# EAGLE schematic Slave BMS ESKD (EAGLE 9.5.2)
Assembly variants: Full_Assembly_TOP, Full_Assembly_BOT, PC_Test_TOP, PC_Test_BOT
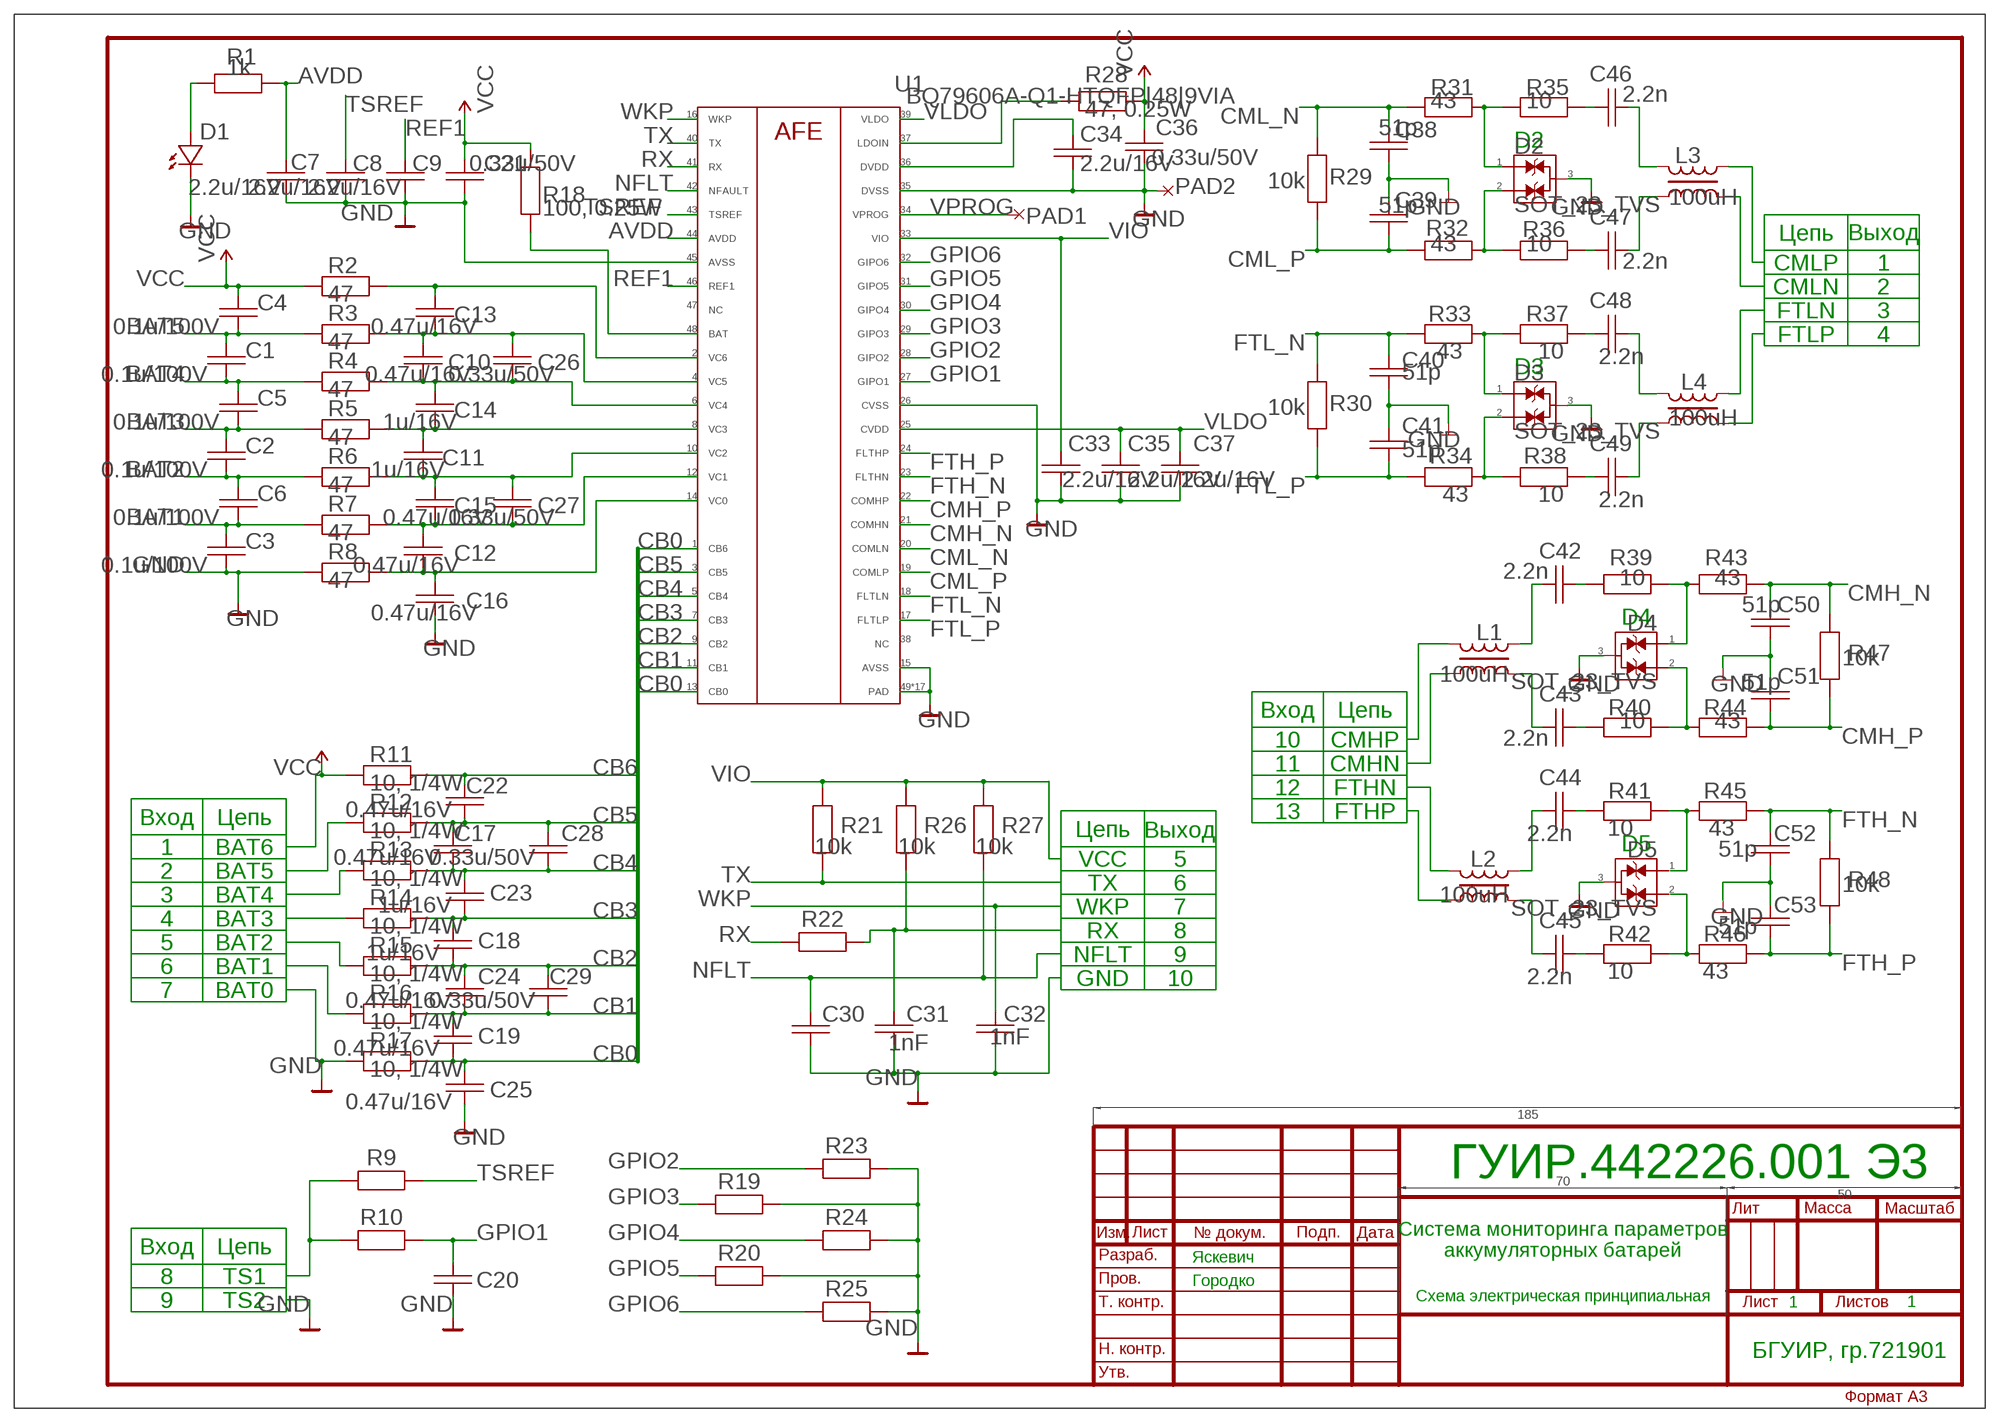
[diagram p0: schematic, sheet 1]

## Parts
C1  0.1u/100V  ESCD_CAP  [C1206]  (not fitted in variant Full_Assembly_BOT)  (not fitted in variant PC_Test_BOT)
C2  0.1u/100V  ESCD_CAP  [C1206]  (not fitted in variant Full_Assembly_BOT)  (not fitted in variant PC_Test_BOT)
C3  0.1u/100V  ESCD_CAP  [C1206]  (not fitted in variant Full_Assembly_BOT)  (not fitted in variant PC_Test_BOT)
C4  0.1u/100V  ESCD_CAP  [C1206]  (not fitted in variant Full_Assembly_BOT)  (not fitted in variant PC_Test_BOT)
C5  0.1u/100V  ESCD_CAP  [C1206]  (not fitted in variant Full_Assembly_BOT)  (not fitted in variant PC_Test_BOT)
C6  0.1u/100V  ESCD_CAP  [C1206]  (not fitted in variant Full_Assembly_BOT)  (not fitted in variant PC_Test_BOT)
C7  2.2u/16V  ESCD_CAP  [C1206]  (not fitted in variant Full_Assembly_BOT)  (not fitted in variant PC_Test_BOT)
C8  2.2u/16V  ESCD_CAP  [C1206]  (not fitted in variant Full_Assembly_BOT)  (not fitted in variant PC_Test_BOT)
C9  2.2u/16V  ESCD_CAP  [C1206]  (not fitted in variant Full_Assembly_BOT)  (not fitted in variant PC_Test_BOT)
C10  0.47u/16V  ESCD_CAP  [C1206]  (not fitted in variant Full_Assembly_BOT)  (not fitted in variant PC_Test_BOT)
C11  1u/16V  ESCD_CAP  [C1206]  (not fitted in variant Full_Assembly_BOT)  (not fitted in variant PC_Test_BOT)
C12  0.47u/16V  ESCD_CAP  [C1206]  (not fitted in variant Full_Assembly_BOT)  (not fitted in variant PC_Test_BOT)
C13  0.47u/16V  ESCD_CAP  [C1206]  (not fitted in variant Full_Assembly_BOT)  (not fitted in variant PC_Test_BOT)
C14  1u/16V  ESCD_CAP  [C1206]  (not fitted in variant Full_Assembly_BOT)  (not fitted in variant PC_Test_BOT)
C15  0.47u/16V  ESCD_CAP  [C1206]  (not fitted in variant Full_Assembly_BOT)  (not fitted in variant PC_Test_BOT)
C16  0.47u/16V  ESCD_CAP  [C1206]  (not fitted in variant Full_Assembly_BOT)  (not fitted in variant PC_Test_BOT)
C17  0.47u/16V  ESCD_CAP  [C1206]  (not fitted in variant Full_Assembly_BOT)  (not fitted in variant PC_Test_BOT)
C18  1u/16V  ESCD_CAP  [C1206]  (not fitted in variant Full_Assembly_BOT)  (not fitted in variant PC_Test_BOT)
C19  0.47u/16V  ESCD_CAP  [C1206]  (not fitted in variant Full_Assembly_BOT)  (not fitted in variant PC_Test_BOT)
C20  ESCD_CAP  [C1206]
C21  0.33u/50V  ESCD_CAP  [C1206]  (not fitted in variant Full_Assembly_BOT)  (not fitted in variant PC_Test_BOT)
C22  0.47u/16V  ESCD_CAP  [C1206]  (not fitted in variant Full_Assembly_BOT)  (not fitted in variant PC_Test_BOT)
C23  1u/16V  ESCD_CAP  [C1206]  (not fitted in variant Full_Assembly_BOT)  (not fitted in variant PC_Test_BOT)
C24  0.47u/16V  ESCD_CAP  [C1206]  (not fitted in variant Full_Assembly_BOT)  (not fitted in variant PC_Test_BOT)
C25  0.47u/16V  ESCD_CAP  [C1206]  (not fitted in variant Full_Assembly_BOT)  (not fitted in variant PC_Test_BOT)
C26  0.33u/50V  ESCD_CAP  [C1206]  (not fitted in variant Full_Assembly_BOT)  (not fitted in variant PC_Test_BOT)
C27  0.33u/50V  ESCD_CAP  [C1206]  (not fitted in variant Full_Assembly_BOT)  (not fitted in variant PC_Test_BOT)
C28  0.33u/50V  ESCD_CAP  [C1206]  (not fitted in variant Full_Assembly_BOT)  (not fitted in variant PC_Test_BOT)
C29  0.33u/50V  ESCD_CAP  [C1206]  (not fitted in variant Full_Assembly_BOT)  (not fitted in variant PC_Test_BOT)
C30  ESCD_CAP  [C1206]
C31  1nF  ESCD_CAP  [C1206]  (not fitted in variant Full_Assembly_BOT)  (not fitted in variant PC_Test_BOT)
C32  1nF  ESCD_CAP  [C1206]  (not fitted in variant Full_Assembly_BOT)  (not fitted in variant PC_Test_BOT)
C33  2.2u/16V  ESCD_CAP  [C1206]  (not fitted in variant Full_Assembly_BOT)  (not fitted in variant PC_Test_BOT)
C34  2.2u/16V  ESCD_CAP  [C1206]  (not fitted in variant Full_Assembly_BOT)  (not fitted in variant PC_Test_BOT)
C35  2.2u/16V  ESCD_CAP  [C1206]  (not fitted in variant Full_Assembly_BOT)  (not fitted in variant PC_Test_BOT)
C36  0.33u/50V  ESCD_CAP  [C1206]  (not fitted in variant Full_Assembly_BOT)  (not fitted in variant PC_Test_BOT)
C37  2.2u/16V  ESCD_CAP  [C1206]  (not fitted in variant Full_Assembly_BOT)  (not fitted in variant PC_Test_BOT)
C38  51p  ESCD_CAP  [C1206]  (not fitted in variant Full_Assembly_BOT)  (not fitted in variant PC_Test_BOT)
C39  51p  ESCD_CAP  [C1206]  (not fitted in variant Full_Assembly_BOT)  (not fitted in variant PC_Test_BOT)
C40  51p  ESCD_CAP  [C1206]  (not fitted in variant Full_Assembly_BOT)  (not fitted in variant PC_Test_BOT)
C41  51p  ESCD_CAP  [C1206]  (not fitted in variant Full_Assembly_BOT)  (not fitted in variant PC_Test_BOT)
C42  2.2n  ESCD_CAP  [C1206]  (not fitted in variant Full_Assembly_BOT)  (not fitted in variant PC_Test_BOT)
C43  2.2n  ESCD_CAP  [C1206]  (not fitted in variant Full_Assembly_BOT)  (not fitted in variant PC_Test_BOT)
C44  2.2n  ESCD_CAP  [C1206]  (not fitted in variant Full_Assembly_BOT)  (not fitted in variant PC_Test_BOT)
C45  2.2n  ESCD_CAP  [C1206]  (not fitted in variant Full_Assembly_BOT)  (not fitted in variant PC_Test_BOT)
C46  2.2n  ESCD_CAP  [C1206]  (not fitted in variant Full_Assembly_BOT)  (not fitted in variant PC_Test_BOT)
C47  2.2n  ESCD_CAP  [C1206]  (not fitted in variant Full_Assembly_BOT)  (not fitted in variant PC_Test_BOT)
C48  2.2n  ESCD_CAP  [C1206]  (not fitted in variant Full_Assembly_BOT)  (not fitted in variant PC_Test_BOT)
C49  2.2n  ESCD_CAP  [C1206]  (not fitted in variant Full_Assembly_BOT)  (not fitted in variant PC_Test_BOT)
C50  51p  ESCD_CAP  [C1206]  (not fitted in variant Full_Assembly_BOT)  (not fitted in variant PC_Test_BOT)
C51  51p  ESCD_CAP  [C1206]  (not fitted in variant Full_Assembly_BOT)  (not fitted in variant PC_Test_BOT)
C52  51p  ESCD_CAP  [C1206]  (not fitted in variant Full_Assembly_BOT)  (not fitted in variant PC_Test_BOT)
C53  51p  ESCD_CAP  [C1206]  (not fitted in variant Full_Assembly_BOT)  (not fitted in variant PC_Test_BOT)
D1  ESCD_LED  [SOD106A]
D2  SOT_23_TVS  [SOT23]
D3  SOT_23_TVS  [SOT23]
D4  SOT_23_TVS  [SOT23]
D5  SOT_23_TVS  [SOT23]
L1  100uH  TDK_ACT45BIND_BOURNS_SRF4532-M  [ACT45B]  (not fitted in variant Full_Assembly_BOT)  (not fitted in variant PC_Test_BOT)
L2  100uH  TDK_ACT45BIND_BOURNS_SRF4532-M  [ACT45B]  (not fitted in variant Full_Assembly_BOT)  (not fitted in variant PC_Test_BOT)
L3  100uH  TDK_ACT45BIND_BOURNS_SRF4532-M  [ACT45B]  (not fitted in variant Full_Assembly_BOT)  (not fitted in variant PC_Test_BOT)
L4  100uH  TDK_ACT45BIND_BOURNS_SRF4532-M  [ACT45B]  (not fitted in variant Full_Assembly_BOT)  (not fitted in variant PC_Test_BOT)
PAD1  SMD_PAD  [SMD_PAD]  (not fitted in variant Full_Assembly_BOT)  (not fitted in variant PC_Test_BOT)
PAD2  SMD_PAD  [SMD_PAD]  (not fitted in variant Full_Assembly_BOT)  (not fitted in variant PC_Test_BOT)
R1  1k  ESCD_RES  [R1206]  (not fitted in variant Full_Assembly_BOT)  (not fitted in variant PC_Test_BOT)
R2  47  ESCD_RES  [R1206]  (not fitted in variant Full_Assembly_BOT)  (not fitted in variant PC_Test_BOT)
R3  47  ESCD_RES  [R1206]  (not fitted in variant Full_Assembly_BOT)  (not fitted in variant PC_Test_BOT)
R4  47  ESCD_RES  [R1206]  (not fitted in variant Full_Assembly_BOT)  (not fitted in variant PC_Test_BOT)
R5  47  ESCD_RES  [R1206]  (not fitted in variant Full_Assembly_BOT)  (not fitted in variant PC_Test_BOT)
R6  47  ESCD_RES  [R1206]  (not fitted in variant Full_Assembly_BOT)  (not fitted in variant PC_Test_BOT)
R7  47  ESCD_RES  [R1206]  (not fitted in variant Full_Assembly_BOT)  (not fitted in variant PC_Test_BOT)
R8  47  ESCD_RES  [R1206]  (not fitted in variant Full_Assembly_BOT)  (not fitted in variant PC_Test_BOT)
R9  ESCD_RES  [R1206]
R10  ESCD_RES  [R1206]
R11  10, 1/4W  ESCD_RES  [R1206]  (not fitted in variant Full_Assembly_BOT)  (not fitted in variant PC_Test_BOT)
R12  10, 1/4W  ESCD_RES  [R1206]  (not fitted in variant Full_Assembly_BOT)  (not fitted in variant PC_Test_BOT)
R13  10, 1/4W  ESCD_RES  [R1206]  (not fitted in variant Full_Assembly_BOT)  (not fitted in variant PC_Test_BOT)
R14  10, 1/4W  ESCD_RES  [R1206]  (not fitted in variant Full_Assembly_BOT)  (not fitted in variant PC_Test_BOT)
R15  10, 1/4W  ESCD_RES  [R1206]  (not fitted in variant Full_Assembly_BOT)  (not fitted in variant PC_Test_BOT)
R16  10, 1/4W  ESCD_RES  [R1206]  (not fitted in variant Full_Assembly_BOT)  (not fitted in variant PC_Test_BOT)
R17  10, 1/4W  ESCD_RES  [R1206]  (not fitted in variant Full_Assembly_BOT)  (not fitted in variant PC_Test_BOT)
R18  100, 0.25W  ESCD_RES  [R1206]  (not fitted in variant Full_Assembly_BOT)  (not fitted in variant PC_Test_BOT)
R19  ESCD_RES  [R1206]
R20  ESCD_RES  [R1206]
R21  10k  ESCD_RES  [R1206]  (not fitted in variant Full_Assembly_BOT)  (not fitted in variant PC_Test_BOT)
R22  ESCD_RES  [R1206]
R23  ESCD_RES  [R1206]
R24  ESCD_RES  [R1206]
R25  ESCD_RES  [R1206]
R26  10k  ESCD_RES  [R1206]  (not fitted in variant Full_Assembly_BOT)  (not fitted in variant PC_Test_BOT)
R27  10k  ESCD_RES  [R1206]  (not fitted in variant Full_Assembly_BOT)  (not fitted in variant PC_Test_BOT)
R28  47, 0.25W  ESCD_RES  [R1206]  (not fitted in variant Full_Assembly_BOT)  (not fitted in variant PC_Test_BOT)
R29  10k  ESCD_RES  [R1206]  (not fitted in variant Full_Assembly_BOT)  (not fitted in variant PC_Test_BOT)
R30  10k  ESCD_RES  [R1206]  (not fitted in variant Full_Assembly_BOT)  (not fitted in variant PC_Test_BOT)
R31  43  ESCD_RES  [R1206]  (not fitted in variant Full_Assembly_BOT)  (not fitted in variant PC_Test_BOT)
R32  43  ESCD_RES  [R1206]  (not fitted in variant Full_Assembly_BOT)  (not fitted in variant PC_Test_BOT)
R33  43  ESCD_RES  [R1206]  (not fitted in variant Full_Assembly_BOT)  (not fitted in variant PC_Test_BOT)
R34  43  ESCD_RES  [R1206]  (not fitted in variant Full_Assembly_BOT)  (not fitted in variant PC_Test_BOT)
R35  10  ESCD_RES  [R1206]  (not fitted in variant Full_Assembly_BOT)  (not fitted in variant PC_Test_BOT)
R36  10  ESCD_RES  [R1206]  (not fitted in variant Full_Assembly_BOT)  (not fitted in variant PC_Test_BOT)
R37  10  ESCD_RES  [R1206]  (not fitted in variant Full_Assembly_BOT)  (not fitted in variant PC_Test_BOT)
R38  10  ESCD_RES  [R1206]  (not fitted in variant Full_Assembly_BOT)  (not fitted in variant PC_Test_BOT)
R39  10  ESCD_RES  [R1206]  (not fitted in variant Full_Assembly_BOT)  (not fitted in variant PC_Test_BOT)
R40  10  ESCD_RES  [R1206]  (not fitted in variant Full_Assembly_BOT)  (not fitted in variant PC_Test_BOT)
R41  10  ESCD_RES  [R1206]  (not fitted in variant Full_Assembly_BOT)  (not fitted in variant PC_Test_BOT)
R42  10  ESCD_RES  [R1206]  (not fitted in variant Full_Assembly_BOT)  (not fitted in variant PC_Test_BOT)
R43  43  ESCD_RES  [R1206]  (not fitted in variant Full_Assembly_BOT)  (not fitted in variant PC_Test_BOT)
R44  43  ESCD_RES  [R1206]  (not fitted in variant Full_Assembly_BOT)  (not fitted in variant PC_Test_BOT)
R45  43  ESCD_RES  [R1206]  (not fitted in variant Full_Assembly_BOT)  (not fitted in variant PC_Test_BOT)
R46  43  ESCD_RES  [R1206]  (not fitted in variant Full_Assembly_BOT)  (not fitted in variant PC_Test_BOT)
R47  10k  ESCD_RES  [R1206]  (not fitted in variant Full_Assembly_BOT)  (not fitted in variant PC_Test_BOT)
R48  10k  ESCD_RES  [R1206]  (not fitted in variant Full_Assembly_BOT)  (not fitted in variant PC_Test_BOT)
U1  BQ79606A-Q1-HTQFP|48|9VIA  [HTQFP48-9X9MM-VIA]  (not fitted in variant Full_Assembly_BOT)  (not fitted in variant PC_Test_BOT)

## Nets
AVDD: C7.1 R1.2 U1.44(AVDD)
BAT: R18.1 U1.48(BAT)
BAT1: C3.2 C6.1 R7.1 R16.1
BAT2: C2.1 C6.2 R6.1 R15.1
BAT3: C2.2 C5.1 R5.1 R14.1
BAT4: C1.1 C5.2 R4.1 R13.1
BAT5: C1.2 C4.1 R3.1 R12.1
CB0: C19.1 C25.2 R17.2 U1.1(CB6) U1.13(CB0)
CB1: C19.2 C24.1 C29.1 R16.2 U1.11(CB1)
CB2: C18.1 C24.2 C29.2 R15.2 U1.9(CB2)
CB3: C18.2 C23.1 R14.2 U1.7(CB3)
CB4: C17.1 C23.2 C28.1 R13.2 U1.5(CB4)
CB5: C17.2 C22.1 C28.2 R12.2 U1.3(CB5)
CB6: C22.2 R11.2
CL1_N: C46.2 R35.2
CL1_N1: C42.2 R39.2
CL1_P: C47.2 R36.2
CL1_P1: C43.2 R40.2
CL2_N: C46.1 L3.1
CL2_N1: C42.1 L1.1
CL2_P: C47.1 L3.2
CL2_P1: C43.1 L1.2
CL_N: D2.1 R31.2 R35.1
CL_N1: D4.1 R39.1 R43.2
CL_P: D2.2 R32.2 R36.1
CL_P1: D4.2 R40.1 R44.2
CMH_N: C50.2 R43.1 R47.1 U1.21(COMHN)
CMH_P: C51.2 R44.1 R47.2 U1.22(COMHP)
CML_N: C38.2 R29.1 R31.1 U1.20(COMLN)
CML_P: C39.2 R29.2 R32.1 U1.19(COMLP)
DVDD: C34.1 U1.36(DVDD)
FL1_N: C48.2 R37.2
FL1_N1: C44.2 R41.2
FL1_P: C49.2 R38.2
FL1_P1: C45.2 R42.2
FL2_N: C48.1 L4.1
FL2_N1: C44.1 L2.1
FL2_P: C49.1 L4.2
FL2_P1: C45.1 L2.2
FL_N: R33.2 R37.1
FL_N1: R41.1 R45.2
FL_P: R34.2 R38.1
FL_P1: R42.1 R46.2
FTH_N: C52.2 R45.1 R48.1 U1.23(FLTHN)
FTH_P: C53.2 R46.1 R48.2 U1.24(FLTHP)
FTL_N: C40.2 R30.1 R33.1 U1.18(FLTLN)
FTL_P: C41.2 R30.2 R34.1 U1.17(FLTLP)
GND: C3.1 C7.2 C8.2 C9.2 C16.1 C20.2 C21.2 C25.1 C30.2 C31.1 C32.1 C33.2 C34.2 C35.2 C36.2 C37.2 C38.1 C39.1 C40.1 C41.1 C50.1 C51.1 C52.1 C53.1 D1.K D2.3 D3.3 D4.3 D5.3 PAD2.1(P) R8.1 R17.1 R19.2 R20.2 R23.2 R24.2 R25.2 U1.15(AVSS) U1.26(CVSS) U1.35(DVSS) U1.45(AVSS) U1.49(PAD) U1.491(PAD) U1.492(PAD) U1.493(PAD) U1.494(PAD) U1.495(PAD) U1.496(PAD) U1.497(PAD) U1.498(PAD) U1.499(PAD) U1.P$1(PAD) U1.P$2(PAD) U1.P$3(PAD) U1.P$4(PAD) U1.P$5(PAD) U1.P$6(PAD) U1.P$7(PAD)
GPIO1: C20.1 R10.2 U1.27(GIPO1)
GPIO2: R23.1 U1.28(GIPO2)
GPIO3: R19.1 U1.29(GIPO3)
GPIO4: R24.1 U1.30(GIPO4)
GPIO5: R20.1 U1.31(GIPO5)
GPIO6: R25.1 U1.32(GIPO6)
LDOIN: R28.1 U1.37(LDOIN)
N$2: D1.A R1.1
N$4: L3.3
N$5: R9.1 R10.1
N$6: L3.4
N$7: L4.4
N$9: C31.2 R22.2 R26.1
N$12: L4.3
N$14: L1.3
N$15: L1.4
N$16: L2.4
N$17: L2.3
NFLT: C30.1 R27.1 U1.42(NFAULT)
REF1: C9.1 U1.46(REF1)
RX: R22.1 U1.41(RX)
TSREF: C8.1 R9.2 U1.43(TSREF)
TX: R21.1 U1.40(TX)
VC0: C12.1 C16.2 R8.2 U1.14(VC0)
VC1: C12.2 C15.1 C27.1 R7.2 U1.12(VC1)
VC2: C11.1 C15.2 C27.2 R6.2 U1.10(VC2)
VC3: C11.2 C14.1 R5.2 U1.8(VC3)
VC4: C10.1 C14.2 C26.1 R4.2 U1.6(VC4)
VC5: C10.2 C13.1 C26.2 R3.2 U1.4(VC5)
VC6: C13.2 R2.2 U1.2(VC6)
VCC [Power]: C4.2 C21.1 C36.1 R2.1 R11.1 R18.2 R28.2
VIO: C33.1 R21.2 R26.2 R27.2 U1.33(VIO)
VLDO: C35.1 C37.1 U1.25(CVDD) U1.39(VLDO)
VPROG: PAD1.1(P) U1.34(VPROG)
WKP: C32.2 U1.16(WKP)
Unconnected: D3.1 D3.2 D5.1 D5.2 U1.38(NC) U1.47(NC)

## Notes on the sheet
- D2
- Цепь | Выход
- CMLP | 1
- CMLN | 2
- FTLN | 3
- FTLP | 4
- D3
- D4
- Вход | Цепь
- 10 | CMHP
- 11 | CMHN
- 12 | FTHN
- Вход | Цепь | 13 | FTHP
- Цепь | D5
- Выход
- 1 | BAT6
- VCC | 5
- 2 | BAT5
- TX | 6
- 3 | BAT4
- WKP | 7
- 4 | BAT3
- RX | 8
- 5 | BAT2
- NFLT | 9
- 6 | BAT1
- GND | 10
- 7 | BAT0
- ГУИР.442226.001 Э3
- Система мониторинга параметров
  аккумуляторных батарей
- Вход | Цепь
- Яскевич
- 8 | TS1
- Городко
- 9 | TS2 | Схема электрическая принципиальная
- 1 | 1
- БГУИР, гр.721901

## Library data of the parts
C1-C53 = ESCD:ESCD_CAP
D1 = ESCD:ESCD_LED: DIODE; MPN: BYS10/45; OC_FARNELL: 9549188; OC_NEWARK: 96K7236
D2-D5 = ESCD:SOT_23_TVS; SUITTABLE_FOR: SM12-02HTG
L1-L4 = ESCD:TDK_ACT45B: 100uH
PAD1 PAD2 = testing:SMD_PAD: SMD PAD
R1-R48 = ESCD:ESCD_RES
U1 = ESCD:BQ79606A-Q1-: Precision battery monitor Model suitable for BQ79606A-Q1 Updated: 18.10.19 by Andrey Dovnar, andrevdovnar@gmail.com HTQFP|48|9VIA package added: 07.11.19 by Denis Yaskevich, denis.jaskevich@yandex.by

## Net classes
1 Power: clearance 0.203 mm